# EasyEDA Pro project FOX_HTOL_test_1.0.eprj

# Schematic Schematic1
Create Date: 2023-11-06; Page Name: P1; Project Name: FOX_HTOL; Schematic Name: Schematic1; Update Date: 2023-11-07; Company: 嘉立创EDA; Page Size: A4; Version: V1.0
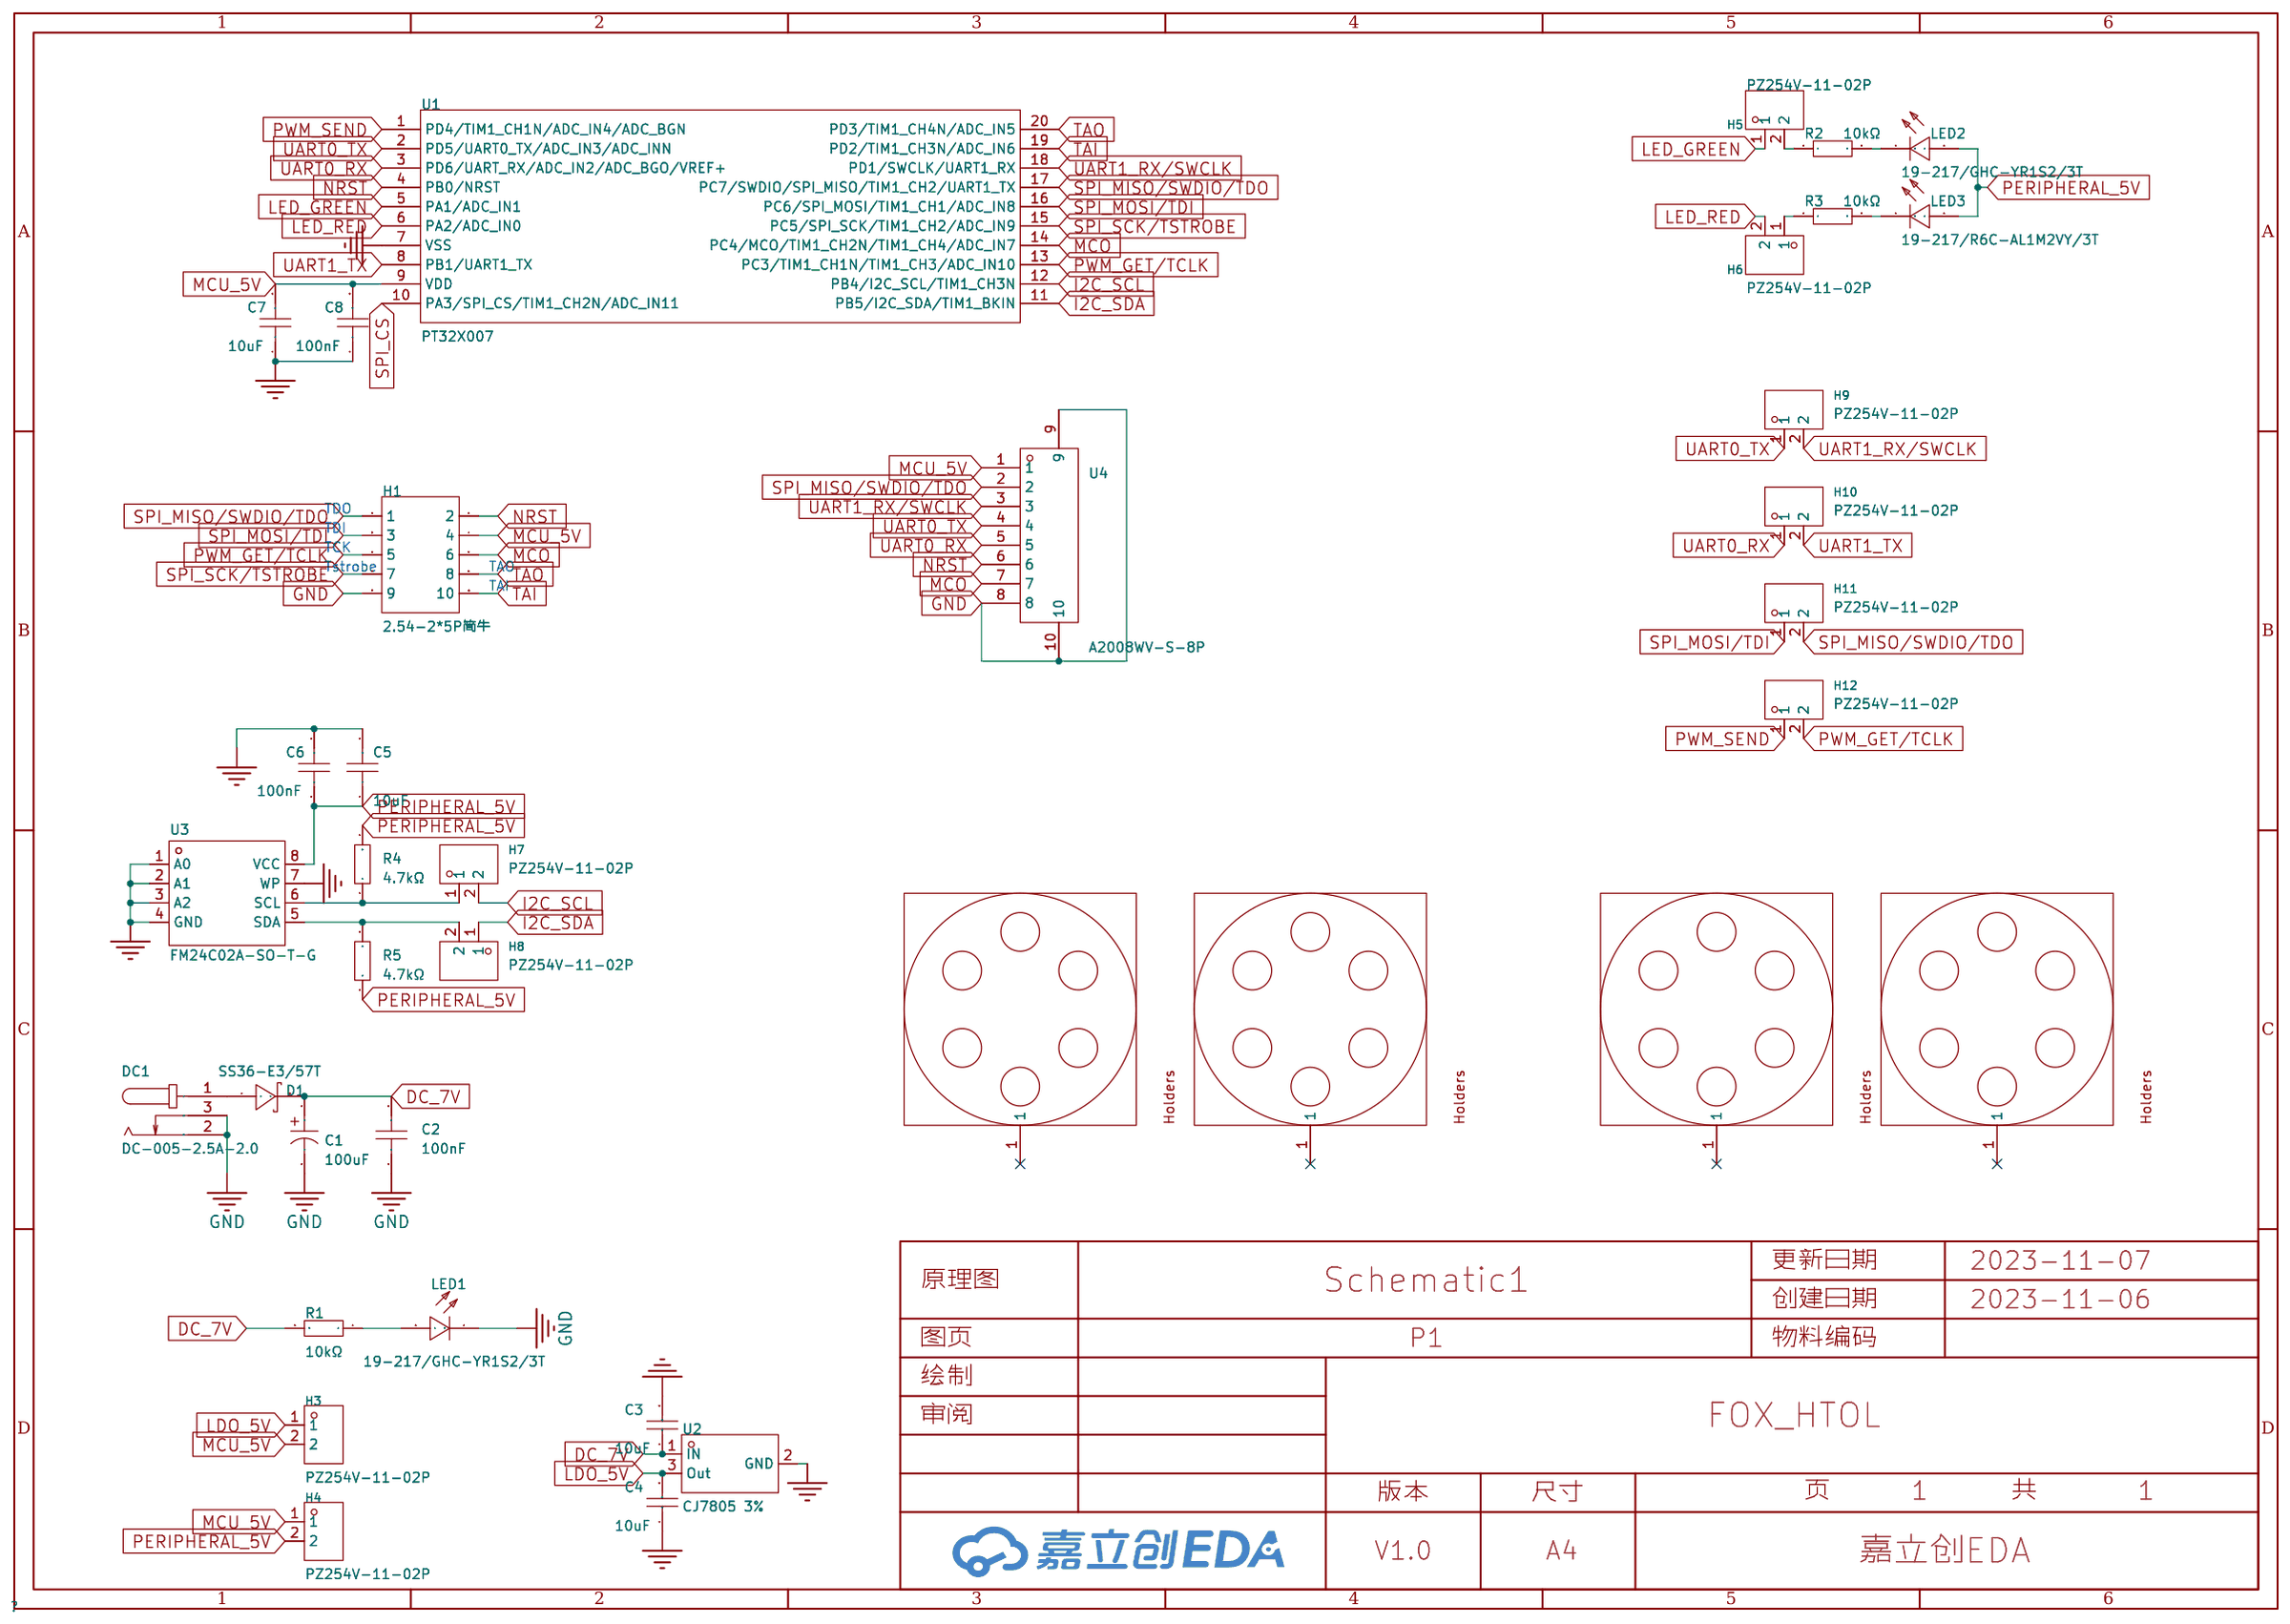
[diagram p0: schematic sheet]

## Parts
C1  100uF  [CAP-SMD_BD6.3-L6.6-W6.6-LS7.6-FD-1]
C2  100nF  [C0603]
C3  10uF  [C1206]
C4  10uF  [C1206]
C5  10uF  [C0603]
C6  100nF  [C0603]
C7  10uF  [C0603]
C8  100nF  [C0603]
D1  SS36-E3/57T  [SMC_L7.1-W6.2-LS8.1-R-RD]
DC1  DC-005-2.5A-2.0  [CONN-TH_DC-005-2.5A-2.0]
H1  2.54-2*5P简牛  [IDC-TH_10P-P2.54_C5665]
H3  PZ254V-11-02P  [HDR-TH_2P-P2.54-V-M]
H4  PZ254V-11-02P  [HDR-TH_2P-P2.54-V-M]
H5  PZ254V-11-02P  [HDR-TH_2P-P2.54-V-M]
H6  PZ254V-11-02P  [HDR-TH_2P-P2.54-V-M]
H7  PZ254V-11-02P  [HDR-TH_2P-P2.54-V-M]
H8  PZ254V-11-02P  [HDR-TH_2P-P2.54-V-M]
H9  PZ254V-11-02P  [HDR-TH_2P-P2.54-V-M]
H10  PZ254V-11-02P  [HDR-TH_2P-P2.54-V-M]
H11  PZ254V-11-02P  [HDR-TH_2P-P2.54-V-M]
H12  PZ254V-11-02P  [HDR-TH_2P-P2.54-V-M]
J2  -  [DEMO板安装孔]
J3  -  [DEMO板安装孔]
J4  -  [DEMO板安装孔]
J5  -  [DEMO板安装孔]
LED1  19-217/GHC-YR1S2/3T  [LED0603-RD]
LED2  19-217/GHC-YR1S2/3T  [LED0603-RD]
LED3  19-217/R6C-AL1M2VY/3T  [LED0603-RD]
R1  10kΩ  [R0603]
R2  10kΩ  [R0603]
R3  10kΩ  [R0603]
R4  4.7kΩ  [R0603]
R5  4.7kΩ  [R0603]
U1  PT32X007  [TSSOP-20_L6.5-W4.4-P0.65-LS6.4-BL]
U2  CJ7805 3%  [TO-252-2_L6.6-W6.1-P4.58-LS10.1-BR-CW]
U3  FM24C02A-SO-T-G  [SOP-8_L5.0-W4.0-P1.27-LS6.2-BL]
U4  A2008WV-S-8P  [CONN-SMD_A2008WV-S-8P]

## Library data of the parts
C1 = RVE100UF35V67RV0072: 容值:100uF;额定电压:35V;电容体直径:-;电容体长度:-;纹波电流:-;等效串联电阻:-;工作寿命:-;; LCSC Part Name: 100uF 35V; Supplier Part: C2836437; Manufacturer: KNSCHA(科尼盛); Supplier Footprint: SMD,6.3x7.7mm; JLCPCB Part Class: Extended Part; Datasheet: https://atta.szlcsc.com/upload/public/pdf/source/20220719/B52EB46F8A1558448ED03D8B4CB3C24F.pdf; Supplier: LCSC; Rated Voltage: 35V
C2 = CL10B104KB8NNNC: 容值:100nF;精度:±10%;额定电压:50V;材质(温度系数):X7R;; LCSC Part Name: 100nF ±10% 50V; Supplier Part: C1591; Manufacturer: SAMSUNG(三星); Supplier Footprint: 0603; JLCPCB Part Class: Extended Part; Datasheet: https://atta.szlcsc.com/upload/public/pdf/source/20160103/1457707680512.pdf; Supplier: LCSC; Tolerance: ±10%; Voltage Rated: 50V; Temperature Coefficient: X7R
C3 C4 = CL31A106KBHNNNE: 容值:10uF;精度:±10%;额定电压:50V;材质(温度系数):X5R;; LCSC Part Name: 10uF ±10% 50V; Supplier Part: C13585; Manufacturer: SAMSUNG(三星); Supplier Footprint: 1206; JLCPCB Part Class: Basic Part; Datasheet: https://atta.szlcsc.com/upload/public/pdf/source/20160103/1457707668742.pdf; Supplier: LCSC; Tolerance: ±10%; Voltage Rated: 50V; Temperature Coefficient: X5R
C5 C7 = CL10A106MA8NRNC: 容值:10uF;精度:±20%;额定电压:25V;材质(温度系数):X5R;; LCSC Part Name: 10uF ±20% 25V; Supplier Part: C96446; Manufacturer: SAMSUNG(三星); Supplier Footprint: 0603; JLCPCB Part Class: Basic Part; Datasheet: https://atta.szlcsc.com/upload/public/pdf/source/20170325/1490427913016.pdf; Supplier: LCSC; Tolerance: ±20%; Voltage Rated: 25V; Temperature Coefficient: X5R
C6 C8 = CC0603KRX7R9BB104: 容值:100nF;精度:±10%;额定电压:50V;材质(温度系数):X7R;; LCSC Part Name: 100nF ±10% 50V; Supplier Part: C14663; Manufacturer: YAGEO(国巨); Supplier Footprint: 0603; JLCPCB Part Class: Basic Part; Datasheet: https://atta.szlcsc.com/upload/public/pdf/source/20180910/C282072_33301C7F631E79921B82A8DAC6BCC5B3.pdf; Supplier: LCSC; Tolerance: ±10%; Voltage Rated: 50V; Temperature Coefficient: X7R
D1 = SS36-E3/57T: 直流反向耐压（Vr）:60V;平均整流电流（Io）:3A;正向压降（Vf）:750mV @ 3A;; Supplier Part: C35722; Manufacturer: VISHAY(威世); Supplier Footprint: SMC(DO-214AB); JLCPCB Part Class: Basic Part; Datasheet: https://atta.szlcsc.com/upload/public/pdf/source/20151007/1457707426323.pdf; Supplier: LCSC
DC1 = DC-005-2.5A-2.0: 连接器类型:DC电源插座;安装方式:面板安装;触点内径:2mm;触点外径:6.2mm;额定电流:2.5A;额定电压:24V;触头材质:黄铜;工作温度范围:-20℃~+70℃;焊接温度(最大值):260℃;; LCSC Part Name: DC电源插座 内径:2mm 外径:6.2mm; Supplier Part: C319099; Manufacturer: XKB Connectivity(中国星坤); Supplier Footprint: 插件; JLCPCB Part Class: Extended Part; Datasheet: https://atta.szlcsc.com/upload/public/pdf/source/20230410/3C172F25A51FCA230ABE6D36425CBB3B.pdf; Supplier: LCSC; Connector Type: DC电源插座; Mounting Style: 面板安装; Inside Contact Diameter: 2mm; Outside Contact Diameter: 6.2mm; Current Rating (Max): 2.5A; Voltage Rating (Max): 24V; Contact Material: 黄铜; Operating Temperature Range: -20℃~+70℃; Welding Temperature (Max): 260℃
H1 = 2.54-2*5P简牛: 连接器类型:简牛座;每排PIN数:5;排数:2;间距:2.54mm;行距:2.54mm;封装形式:直插;触头材质:-;触头镀层:-;; LCSC Part Name: 每排P数:5 排数:2 2.54mm; Supplier Part: C5665; Manufacturer: BOOMELE(博穆精密); Supplier Footprint: 插件,P=2.54mm; JLCPCB Part Class: Extended Part; Datasheet: https://atta.szlcsc.com/upload/public/pdf/source/20140331/1457707037896.pdf; Supplier: LCSC; Connector Type: 简牛座; Pin Number in each Row: 5; Number of Rows: 2; Pitch: 2.54mm; Row Spacing: 2.54mm; Holder Type: 直插
H3-H12 = PZ254V-11-02P: 排数:单排;总PIN位数:2P;间距:2.54mm;插针结构:1x2P;行距:-;安装类型:直插;圆针/方针:方针;额定电流:-;额定电压:-;配合针长度:6mm;塑高:2.5mm;端接针长度:3mm;触头材质:黄铜;触头镀层:-;工作温度范围:-40℃~+105℃;颜色:黑色;; LCSC Part Name: 2.54mm 1x2P 直插 方针; Supplier Part: C492401; Manufacturer: XFCN(兴飞); Supplier Footprint: 插件,P=2.54mm; JLCPCB Part Class: Extended Part; Datasheet: https://atta.szlcsc.com/upload/public/pdf/source/20200309/C492401_A812433581A9B211A7FFA413ADDFF0E5.pdf; Supplier: LCSC; Number of Rows: 单排; Number of Pins: 2P; Pitch: 2.54mm; Pin Structure: 1x2P; Mounting Type: 直插; Circluar Pins/Square Pins: 方针; Length of Mating Pin: 6mm; Insulation Height: 2.5mm; Length of End Connection Pin: 3mm; Contact Material: 黄铜; Operating Temperature Range: -40℃~+105℃; Color: 黑色
J2-J5 = 螺孔_3.1X6MM
LED1 LED2 = 19-217/GHC-YR1S2/3T: 发光颜色:翠绿;二极管配置:-;透镜颜色:无色透明;主波长:520nm~535nm;峰值波长:518nm;色温:-;测试电流:20mA;功率:110mW;发光角度:120°;安装方式:-;工作温度:-40℃~+85℃;; LCSC Part Name: 翠绿 520nm~535nm; Supplier Part: C72043; Manufacturer: EVERLIGHT(亿光); Supplier Footprint: 0603; JLCPCB Part Class: Basic Part; Datasheet: https://atta.szlcsc.com/upload/public/pdf/source/20160507/1462613613780.pdf; Supplier: LCSC; Emitted Color: 翠绿; Lens Color: 无色透明; Dominant Wavelength: 520nm~535nm; Peak Wavelength: 518nm; Forward Current: 20mA; Power Dissipation: 110mW; Viewing Angle: 120°; Operating Temperature: -40℃~+85℃
LED3 = 19-217/R6C-AL1M2VY/3T: 发光颜色:红灯;二极管配置:-;透镜颜色:无色透明;主波长:617.5nm;色温:-;功率:60mW;发光角度:120°;安装方式:-;工作温度:-40℃~+85℃;; LCSC Part Name: 红灯 停产; Supplier Part: C72044; Manufacturer: EVERLIGHT(亿光); Supplier Footprint: 0603; JLCPCB Part Class: Extended Part; Datasheet: https://atta.szlcsc.com/upload/public/pdf/source/20160507/1462613613821.pdf; Supplier: LCSC; Emitted Color: 红灯; Lens Color: 无色透明; Dominant Wavelength: 617.5nm; Peak Wavelength: 632nm; Forward Current: 5mA; Forward Voltage (VF): 1.95V; Power Dissipation: 60mW; Viewing Angle: 120°; Operating Temperature: -40℃~+85℃
R1 = 0603WAF1002T5E: 电阻类型:厚膜电阻;阻值:10kΩ;精度:±1%;功率:100mW;温度系数:±100ppm/℃;最大工作电压:75V;工作温度范围:-55℃~+155℃;; LCSC Part Name: 10kΩ ±1% 100mW; Supplier Part: C25804; Manufacturer: UNI-ROYAL(厚声); Supplier Footprint: 0603; JLCPCB Part Class: Basic Part; Datasheet: https://atta.szlcsc.com/upload/public/pdf/source/20200306/C422600_1E6D84923E4A46A82E41ADD87F860B5C.pdf; Supplier: LCSC; Type: 厚膜电阻; Tolerance: ±1%; Power(Watts): 100mW; Temperature Coefficient: ±100ppm/℃; Overload Voltage (Max): 75V; Operating Temperature Range: -55℃~+155℃
R2 R3 = 0603WAF1002T5E: 电阻类型:厚膜电阻;阻值:10kΩ;精度:±1%;功率:100mW;; LCSC Part Name: 10kΩ ±1% 100mW; Supplier Part: C25804; Manufacturer: UNI-ROYAL(厚声); Supplier Footprint: 0603; JLCPCB Part Class: Basic Part; Datasheet: https://atta.szlcsc.com/upload/public/pdf/source/20200306/C422600_1E6D84923E4A46A82E41ADD87F860B5C.pdf; Supplier: LCSC; Type: 厚膜电阻; Tolerance: ±1%; Power(Watts): 100mW; Temperature Coefficient: ±100ppm/℃; Overload Voltage (Max): 75V; Operating Temperature Range: -55℃~+155℃
R4 R5 = 0603WAF4701T5E: 电阻类型:厚膜电阻;阻值:4.7kΩ;精度:±1%;功率:100mW;温度系数:±100ppm/℃;; LCSC Part Name: 厚膜电阻 4.7kΩ ±1% 100mW; Supplier Part: C23162; Manufacturer: UNI-ROYAL(厚声); Supplier Footprint: 0603; JLCPCB Part Class: Basic Part; Datasheet: https://atta.szlcsc.com/upload/public/pdf/source/20200306/C422600_1E6D84923E4A46A82E41ADD87F860B5C.pdf; Supplier: LCSC; Type: 厚膜电阻; Tolerance: ±1%; Power(Watts): 100mW; Temperature Coefficient: ±100ppm/℃; Overload Voltage (Max): 75V; Operating Temperature Range: -55℃~+155℃
U1 = PT32X007
U2 = CJ7805 3%: 输出类型:固定;输出极性:正;最大输入电压:35V;输出电压:5V;输出电流:1.5A;; LCSC Part Name: 3%; Supplier Part: C21706; Manufacturer: CJ(江苏长电/长晶); Supplier Footprint: TO-252-2(DPAK); JLCPCB Part Class: Extended Part; Datasheet: https://atta.szlcsc.com/upload/public/pdf/source/20171106/C21706_15099535628491092916.pdf; Supplier: LCSC; Output Type: 固定; Output Polarity: 正; Number of Outputs: 1; Maximum Input Voltage: 35V; Output Voltage: 5V; Dropout Voltage: 2V@(1A); Output Current: 1.5A
U3 = FM24C02A-SO-T-G: 2-Kbit(256 x 8bit)，I2C接口，工作电压：1.7V to 5.5V; Supplier Part: C9997; Manufacturer: FM(复旦微); Supplier Footprint: SOP-8; JLCPCB Part Class: Extended Part; Datasheet: https://atta.szlcsc.com/upload/public/pdf/source/20140226/1457706994856.pdf; Supplier: LCSC
U4 = A2008WV-S-8P: 参考系列:PH;间距:2mm;插针结构:1x8P;排数:1;每排PIN数:8;行距:-;安装方式:-;触头材质:黄铜;; LCSC Part Name: PH 2mm 1x8P 镀锡; Supplier Part: C273128; Manufacturer: CJT(长江连接器); Supplier Footprint: SMD,P=2mm; JLCPCB Part Class: Extended Part; Datasheet: https://atta.szlcsc.com/upload/public/pdf/source/20180913/C273128_BB1852F7672CD820F7AD4E26555E7BEC.pdf; Supplier: LCSC; Reference Series: PH; Pitch: 2mm; Pins Structure: 1x8P; Number of Rows: 1; Number of PINs Per Row: 8; Contact Material: 黄铜

## Nets
GND: C1.2 C2.1 C3.2 C4.1 C5.2 C6.2 C7.1 C8.1 DC1.2 DC1.3 H1.9 LED1.1(C) U1.7(VSS) U2.2(GND) U3.1(A0) U3.2(A1) U3.3(A2) U3.4(GND) U3.7(WP) U4.8 U4.9 U4.10
DC_7V: C1.1 C2.2 C3.1 D1.2(K) R1.2 U2.1(IN)
I2C_SCL: H7.2 U1.12(PB4/I2C_SCL/TIM1_CH3N)
I2C_SDA: H8.1 U1.11(PB5/I2C_SDA/TIM1_BKIN)
LDO_5V: C4.2 H3.1 U2.3(Out)
LED_GREEN: H5.1 U1.5(PA1/ADC_IN1)
LED_RED: H6.2 U1.6(PA2/ADC_IN0)
MCO: H1.6 U1.14(PC4/MCO/TIM1_CH2N/TIM1_CH4/ADC_IN7) U4.7
MCU_5V: C7.2 C8.2 H1.4 H3.2 H4.1 U1.9(VDD) U4.1
NRST: H1.2 U1.4(PB0/NRST) U4.6
PERIPHERAL_5V: C5.1 C6.1 H4.2 LED2.2(A) LED3.2(A) R4.2 R5.1 U3.8(VCC)
PWM_GET/TCLK: H1.5 H12.2 U1.13(PC3/TIM1_CH1N/TIM1_CH3/ADC_IN10)
PWM_SEND: H12.1 U1.1(PD4/TIM1_CH1N/ADC_IN4/ADC_BGN)
SPI_CS: U1.10(PA3/SPI_CS/TIM1_CH2N/ADC_IN11)
SPI_MISO/SWDIO/TDO: H1.1 H11.2 U1.17(PC7/SWDIO/SPI_MISO/TIM1_CH2/UART1_TX) U4.2
SPI_MOSI/TDI: H1.3 H11.1 U1.16(PC6/SPI_MOSI/TIM1_CH1/ADC_IN8)
SPI_SCK/TSTROBE: H1.7 U1.15(PC5/SPI_SCK/TIM1_CH2/ADC_IN9)
TAI: H1.10 U1.19(PD2/TIM1_CH3N/ADC_IN6)
TAO: H1.8 U1.20(PD3/TIM1_CH4N/ADC_IN5)
UART0_RX: H10.1 U1.3(PD6/UART_RX/ADC_IN2/ADC_BGO/VREF+) U4.5
UART0_TX: H9.1 U1.2(PD5/UART0_TX/ADC_IN3/ADC_INN) U4.4
UART1_RX/SWCLK: H9.2 U1.18(PD1/SWCLK/UART1_RX) U4.3
UART1_TX: H10.2 U1.8(PB1/UART1_TX)
$1N831: D1.1(A) DC1.1
$1N1246: LED1.2(A) R1.1
$1N1959: H5.2 R2.1
$1N1962: H6.1 R3.1
$1N1965: LED2.1(C) R2.2
$1N1968: LED3.1(C) R3.2
$1N2989: H7.1 R4.1 U3.6(SCL)
$1N3006: H8.2 R5.2 U3.5(SDA)

Not connected (* = marked no-connect by the designer): J2 1*; J3 1*; J4 1*; J5 1*

## Notes on the sheet
- TDO
- TDI
- TCK
- Tstrobe
- TAI
- TAO

# Board PCB1
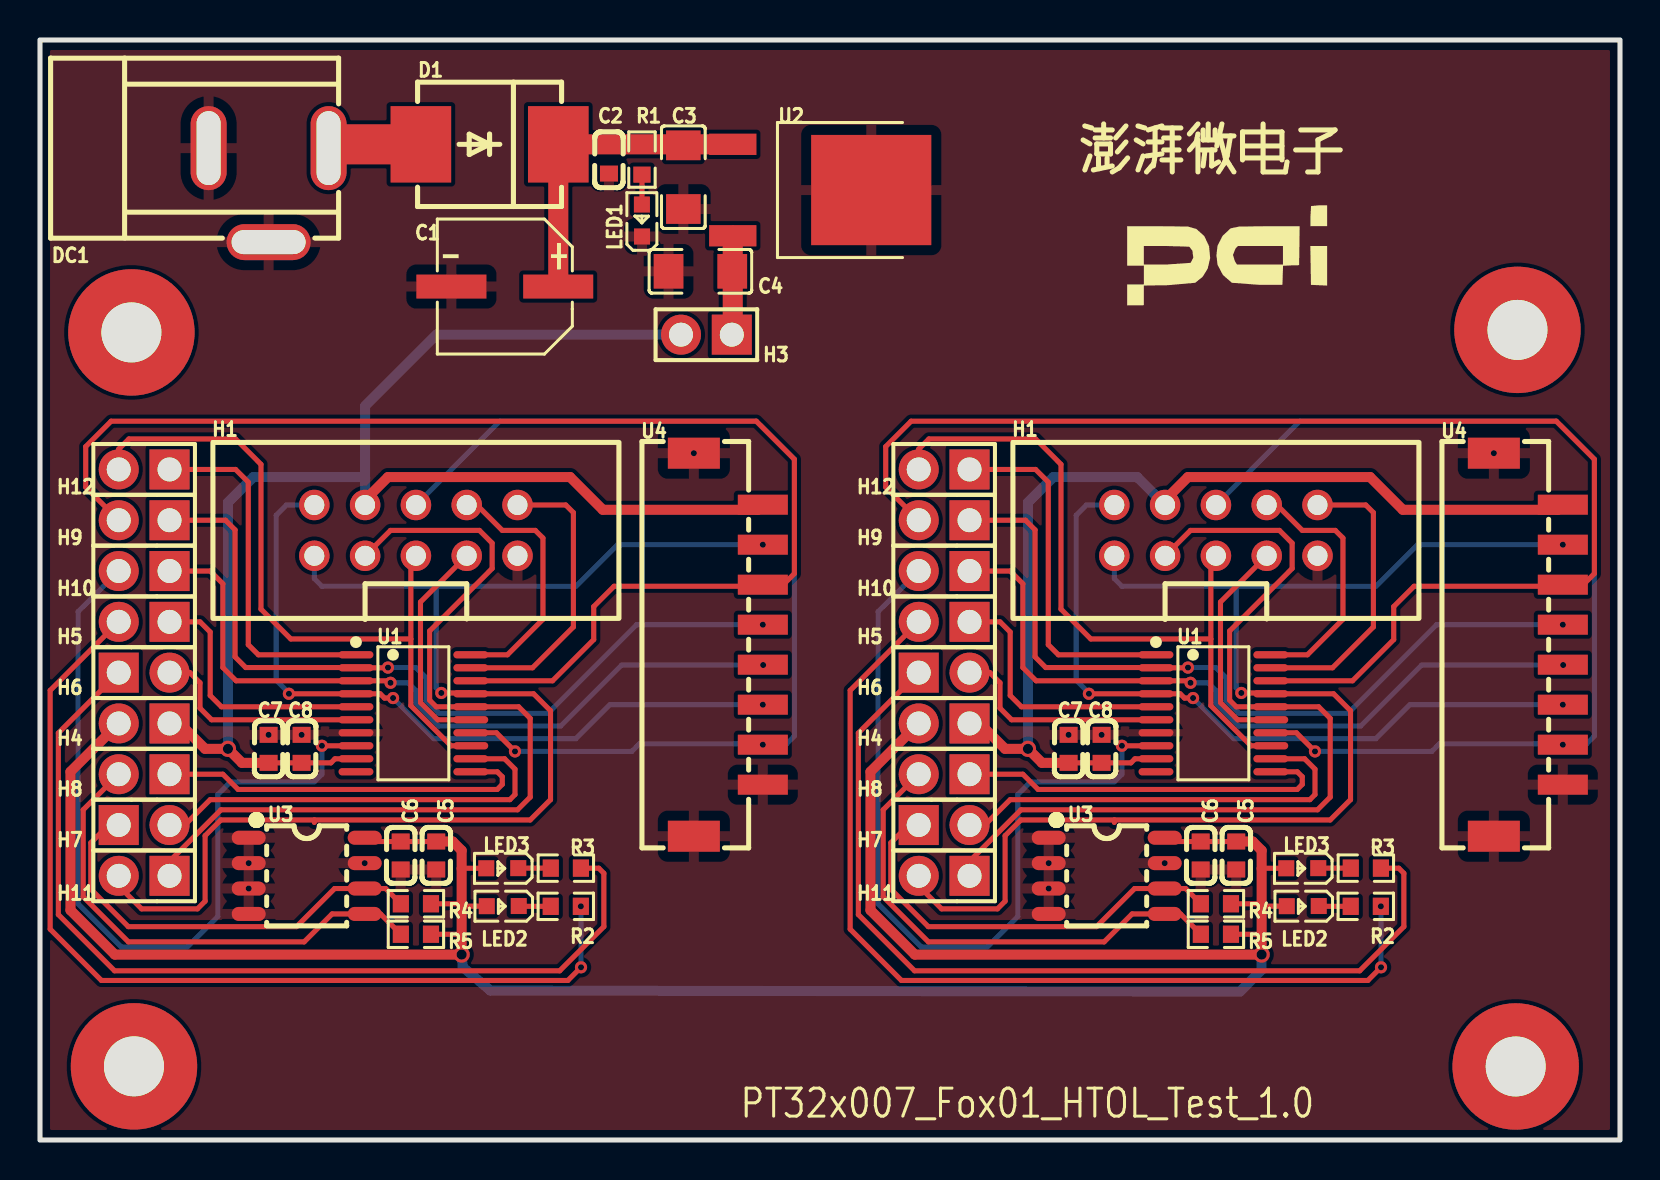
[diagram p1: board, top side]
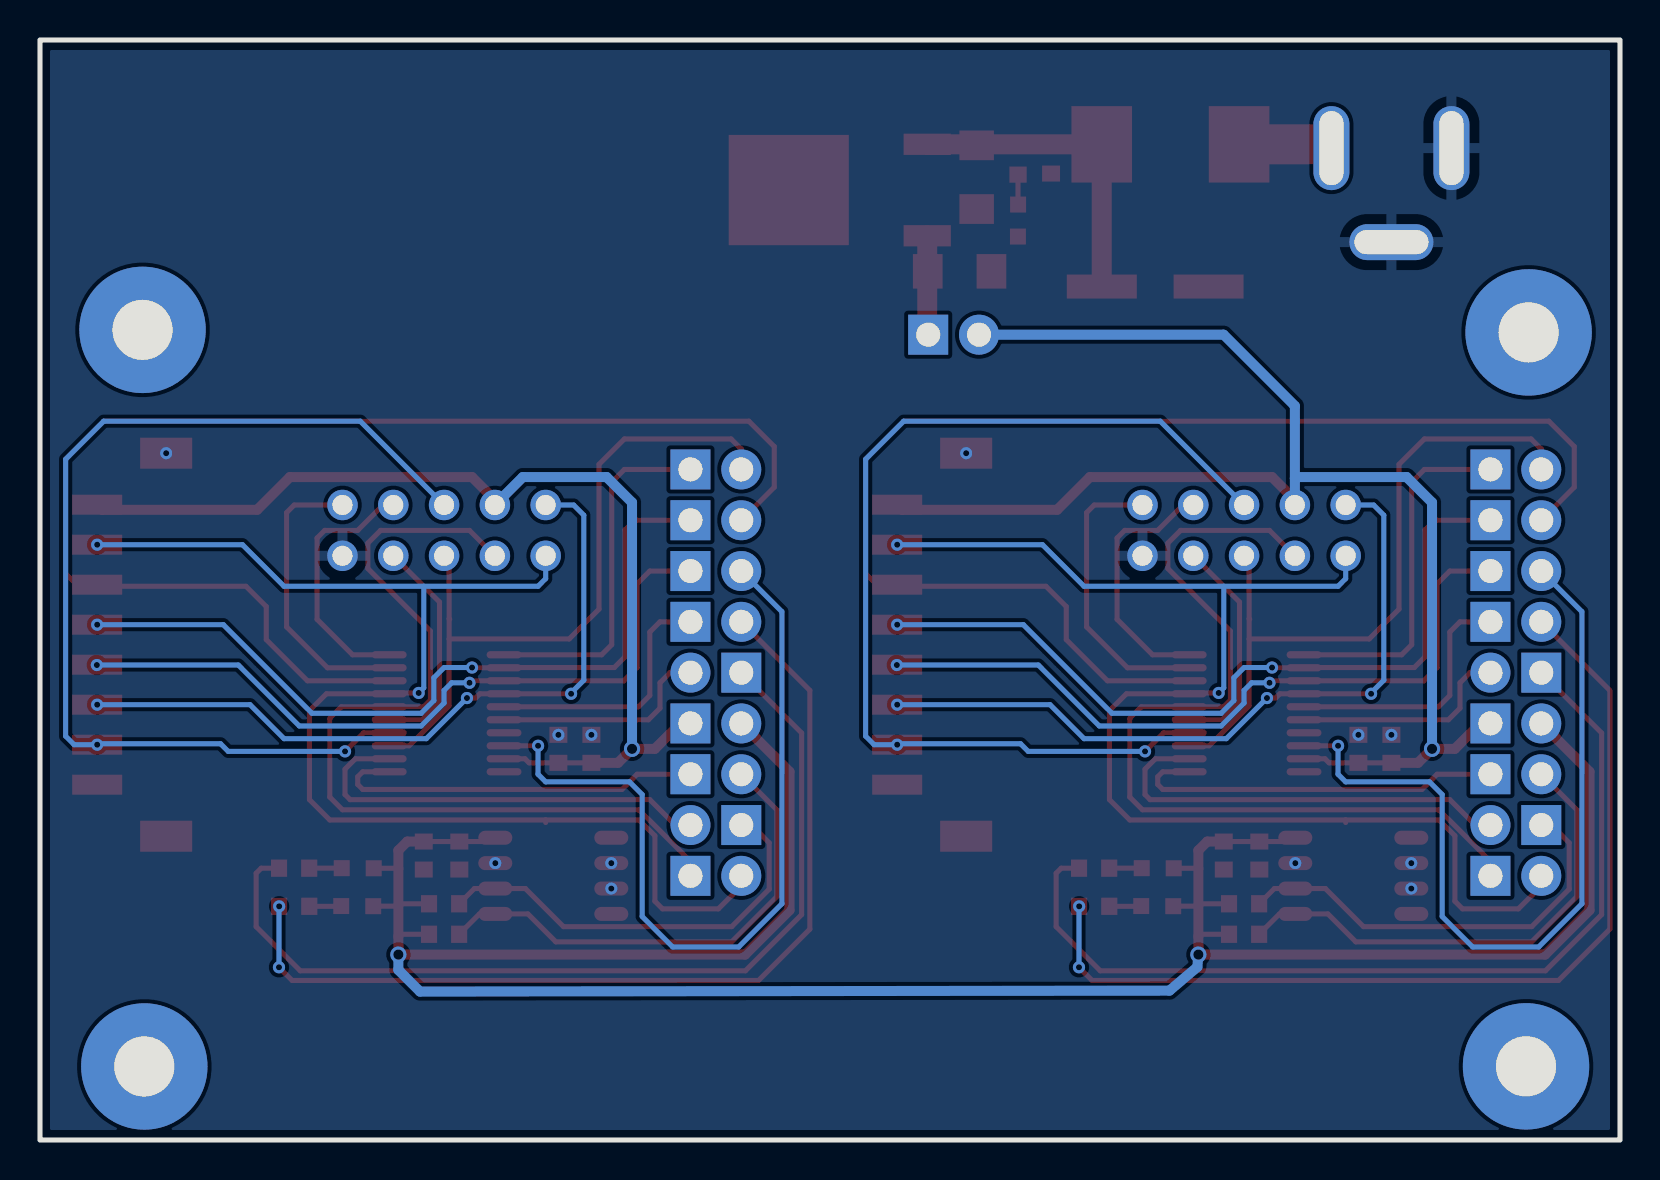
[diagram p2: board, bottom side, seen from below]

Outline 79 x 55 mm; copper layers: Top Layer, Bottom Layer. Coordinates in mm from the lower left corner of the outline.
Outline path: rectangle 0,55 79,0
Stack: Top Layer 0.035mm / Dielectric1 1.51mm FR4 er 4.5 / Bottom Layer 0.035mm

## Design rules (mm)
template: 自定义配置
spacing copperThickness1oz (default): track to track 0.102, other pairs 0.152 to 0.3
spacing copperThickness2oz: track to track 0.203, other pairs 0.152 to 0.3
track width copperThickness1oz (default): min 0.127, default 0.254, max 2.54
track width copperThickness2oz: min 0.203, default 0.254, max 2.54
differential pair differentialPair (default): width min 0.127, default 0.254, max 2.54; gap min 0.152, default 0.152
via viaSize (default): diameter min 0.5, default 0.61, max 10; hole min 0.3, default 0.305, max 6.3

## Placement (name value [footprint] x y rotation side)
C1  100uF  [CAP-SMD_BD6.3-L6.6-W6.6-LS7.6-FD-1]  23.24 42.67 180 top
C2  100nF  [C0603]  28.45 49.02 90 top
C3  10uF  [C1206]  32.17 48.14 270 top
C4  10uF  [C1206]  33.02 43.43 0 top
C5  10uF  [C0603]  19.81 14.22 270 top
C5#2  -  [C0603]  59.81 14.22 270 top
C6  100nF  [C0603]  18.03 14.22 270 top
C6#2  -  [C0603]  58.03 14.22 270 top
C7  10uF  [C0603]  11.43 19.56 270 top
C7#2  -  [C0603]  51.43 19.56 270 top
C8  100nF  [C0603]  53.08 19.56 270 top
C8#2  -  [C0603]  13.08 19.56 270 top
D1  SS36-E3/57T  [SMC_L7.1-W6.2-LS8.1-R-RD]  22.48 49.78 180 top
DC1  DC-005-2.5A-2.0  [CONN-TH_DC-005-2.5A-2.0]  11.43 47.24 0 top
H1  2.54-2*5P简牛  [IDC-TH_10P-P2.54_C5665]  58.8 30.48 0 top
H1#2  -  [IDC-TH_10P-P2.54_C5665]  18.8 30.48 0 top
H3  PZ254V-11-02P  [HDR-TH_2P-P2.54-V-M]  33.32 40.27 180 top
H4  PZ254V-11-02P  [HDR-TH_2P-P2.54-V-M]  45.21 20.83 180 top
H4#2  -  [HDR-TH_2P-P2.54-V-M]  5.21 20.83 180 top
H5  PZ254V-11-02P  [HDR-TH_2P-P2.54-V-M]  45.21 25.91 180 top
H5#2  -  [HDR-TH_2P-P2.54-V-M]  5.21 25.91 180 top
H6  PZ254V-11-02P  [HDR-TH_2P-P2.54-V-M]  45.21 23.37 0 top
H6#2  -  [HDR-TH_2P-P2.54-V-M]  5.21 23.37 0 top
H7  PZ254V-11-02P  [HDR-TH_2P-P2.54-V-M]  5.21 15.75 0 top
H7#2  -  [HDR-TH_2P-P2.54-V-M]  45.21 15.75 0 top
H8  PZ254V-11-02P  [HDR-TH_2P-P2.54-V-M]  5.21 18.29 180 top
H8#2  -  [HDR-TH_2P-P2.54-V-M]  45.21 18.29 180 top
H9  PZ254V-11-02P  [HDR-TH_2P-P2.54-V-M]  5.21 30.99 180 top
H9#2  -  [HDR-TH_2P-P2.54-V-M]  45.21 30.99 180 top
H10  PZ254V-11-02P  [HDR-TH_2P-P2.54-V-M]  5.21 28.45 180 top
H10#2  -  [HDR-TH_2P-P2.54-V-M]  45.21 28.45 180 top
H11  PZ254V-11-02P  [HDR-TH_2P-P2.54-V-M]  5.21 13.21 180 top
H11#2  -  [HDR-TH_2P-P2.54-V-M]  45.21 13.21 180 top
H12  PZ254V-11-02P  [HDR-TH_2P-P2.54-V-M]  5.21 33.53 180 top
H12#2  -  [HDR-TH_2P-P2.54-V-M]  45.21 33.53 180 top
J2  -  [DEMO板安装孔]  73.87 40.51 0 top
J3  -  [DEMO板安装孔]  4.57 40.38 0 top
J4  -  [DEMO板安装孔]  73.79 3.68 0 top
J5  -  [DEMO板安装孔]  4.7 3.68 0 top
LED1  19-217/GHC-YR1S2/3T  [LED0603-RD]  30.1 45.97 90 top
LED2  19-217/GHC-YR1S2/3T  [LED0603-RD]  23.14 11.69 180 top
LED2#2  -  [LED0603-RD]  63.14 11.69 180 top
LED3  19-217/R6C-AL1M2VY/3T  [LED0603-RD]  23.11 13.59 180 top
LED3#2  -  [LED0603-RD]  63.11 13.59 180 top
R1  10kΩ  [R0603]  30.1 49.02 90 top
R2  10kΩ  [R0603]  26.29 11.68 180 top
R2#2  -  [R0603]  66.29 11.68 180 top
R3  10kΩ  [R0603]  26.29 13.59 180 top
R3#2  -  [R0603]  66.29 13.59 180 top
R4  4.7kΩ  [R0603]  18.8 11.81 0 top
R4#2  -  [R0603]  58.8 11.81 0 top
R5  4.7kΩ  [R0603]  18.8 10.29 180 top
R5#2  -  [R0603]  58.8 10.29 180 top
U1  PT32X007  [TSSOP-20_L6.5-W4.4-P0.65-LS6.4-BL]  18.67 21.34 270 top
U1#2  -  [TSSOP-20_L6.5-W4.4-P0.65-LS6.4-BL]  58.67 21.34 270 top
U2  CJ7805 3%  [TO-252-2_L6.6-W6.1-P4.58-LS10.1-BR-CW]  38.1 47.5 180 top
U3  FM24C02A-SO-T-G  [SOP-8_L5.0-W4.0-P1.27-LS6.2-BL]  13.34 13.21 270 top
U3#2  -  [SOP-8_L5.0-W4.0-P1.27-LS6.2-BL]  53.33 13.21 270 top
U4  A2008WV-S-8P  [CONN-SMD_A2008WV-S-8P]  34.42 24.77 270 top
U4#2  -  [CONN-SMD_A2008WV-S-8P]  74.42 24.77 270 top

## Footprints (pads in the part's own frame, mm; a bottom-side part is the same pattern mirrored in y, then rotated)
C0603
  rect 0.8x0.9 smd: 1(-0.7,0) 2(0.7,0)
C1206
  rect 1.485x1.728 smd: 1(-1.593,0) 2(1.593,0)
CAP-SMD_BD6.3-L6.6-W6.6-LS7.6-FD-1
  rect 3.5x1.2 smd: 1(-2.67,0) 2(2.67,0)
CONN-SMD_A2008WV-S-8P
  rect 1x2.5 smd: 1(-7,1.724) 2(-5,1.724) 3(-3,1.724) 4(-1,1.724) 5(1,1.724) 6(2.999,1.724) 7(5,1.724) 8(7,1.724)
  rect 1.55x2.6 smd: 9(-9.575,-1.724) 10(9.575,-1.724)
CONN-TH_DC-005-2.5A-2.0
  oval 1.8x4.2 hole 1.2x3.7: 1(2.999,2.35) 2(-2.999,2.35)
  oval 4.2x1.8 hole 3.7x1.2: 3(0,-2.35)
DEMO板安装孔
  round 6.32 hole 3: 1(0,0)
HDR-TH_2P-P2.54-V-M
  rect 2x2 hole 1.2: 1(-1.27,0)
  round 2 hole 1.2: 2(1.27,0)
IDC-TH_10P-P2.54_C5665
  round 1.524 hole 1: 1(-5.08,-1.27) 2(-5.08,1.27) 3(-2.54,-1.27) 4(-2.54,1.27) 5(0,-1.27) 6(0,1.27) 7(2.54,-1.27) 8(2.54,1.27) 9(5.08,-1.27) 10(5.08,1.27)
LED0603-RD
  rect 0.8x0.8 smd: 1(-0.799,-0.004) 2(0.799,0.004)
R0603
  rect 0.806x0.864 smd: 1(-0.753,0) 2(0.753,0)
SMC_L7.1-W6.2-LS8.1-R-RD
  rect 3.03x3.82 smd: 1(3.435,0) 2(-3.435,0)
SOP-8_L5.0-W4.0-P1.27-LS6.2-BL
  oval 0.7x1.7 smd: 1(-1.905,-2.9) 2(-0.635,-2.9) 3(0.635,-2.9) 4(1.905,-2.9) 5(1.905,2.9) 6(0.635,2.9) 7(-0.635,2.9) 8(-1.905,2.9)
TO-252-2_L6.6-W6.1-P4.58-LS10.1-BR-CW
  rect 2.364x1.064 smd: 1(3.462,-2.286) 3(3.462,2.286)
  rect 6.004x5.512 smd: 2(-3.462,0)
TSSOP-20_L6.5-W4.4-P0.65-LS6.4-BL
  oval 0.364x1.742 smd: 1(-2.925,-2.871) 2(-2.275,-2.871) 3(-1.625,-2.871) 4(-0.975,-2.871) 5(-0.325,-2.871) 6(0.325,-2.871) 7(0.975,-2.871) 8(1.625,-2.871) 9(2.275,-2.871) 10(2.925,-2.871) 11(2.925,2.871) 12(2.275,2.871) 13(1.625,2.871) 14(0.975,2.871) 15(0.325,2.871) 16(-0.325,2.871) 17(-0.975,2.871) 18(-1.625,2.871) 19(-2.275,2.871) 20(-2.925,2.871)

## Nets
GND: C1.2 C2.1 C3.2 C4.1 C5.2 C5#2.2 C6.2 C6#2.2 C7.1 C7#2.1 C8.1 C8#2.1 DC1.2 DC1.3 H1.9 H1#2.9 LED1.1 U1.7 U1#2.7 U2.2 U3.1 U3.2 U3.3 U3.4 U3.7 U3#2.1 U3#2.2 U3#2.3 U3#2.4 U3#2.7 U4.8 U4.9 U4.10 U4#2.8 U4#2.9 U4#2.10
DC_7V: C1.1 C2.2 C3.1 D1.2 R1.2 U2.1
I2C_SCL: H7.2 H7#2.2 U1.12 U1#2.12
I2C_SDA: H8.1 H8#2.1 U1.11 U1#2.11
LDO_5V: C4.2 H3.1 U2.3
LED_GREEN: H5.1 H5#2.1 U1.5 U1#2.5
LED_RED: H6.2 H6#2.2 U1.6 U1#2.6
MCO: H1.6 H1#2.6 U1.14 U1#2.14 U4.7 U4#2.7
MCU_5V: C7.2 C7#2.2 C8.2 C8#2.2 H1.4 H1#2.4 H3.2 H4.1 H4#2.1 U1.9 U1#2.9 U4.1 U4#2.1
NRST: H1.2 H1#2.2 U1.4 U1#2.4 U4.6 U4#2.6
PERIPHERAL_5V: C5.1 C5#2.1 C6.1 C6#2.1 H4.2 H4#2.2 LED2.2 LED2#2.2 LED3.2 LED3#2.2 R4.2 R4#2.2 R5.1 R5#2.1 U3.8 U3#2.8
PWM_GET/TCLK: H1.5 H1#2.5 H12.2 H12#2.2 U1.13 U1#2.13
PWM_SEND: H12.1 H12#2.1 U1.1 U1#2.1
SPI_CS: U1.10 U1#2.10
SPI_MISO/SWDIO/TDO: H1.1 H1#2.1 H11.2 H11#2.2 U1.17 U1#2.17 U4.2 U4#2.2
SPI_MOSI/TDI: H1.3 H1#2.3 H11.1 H11#2.1 U1.16 U1#2.16
SPI_SCK/TSTROBE: H1.7 H1#2.7 U1.15 U1#2.15
TAI: H1.10 H1#2.10 U1.19 U1#2.19
TAO: H1.8 H1#2.8 U1.20 U1#2.20
UART0_RX: H10.1 H10#2.1 U1.3 U1#2.3 U4.5 U4#2.5
UART0_TX: H9.1 H9#2.1 U1.2 U1#2.2 U4.4 U4#2.4
UART1_RX/SWCLK: H9.2 H9#2.2 U1.18 U1#2.18 U4.3 U4#2.3
UART1_TX: H10.2 H10#2.2 U1.8 U1#2.8
$1N831: D1.1 DC1.1
$1N1246: LED1.2 R1.1
$1N1959: H5.2 H5#2.2 R2.1 R2#2.1
$1N1962: H6.1 H6#2.1 R3.1 R3#2.1
$1N1965: LED2.1 LED2#2.1 R2.2 R2#2.2
$1N1968: LED3.1 LED3#2.1 R3.2 R3#2.2
$1N2989: H7.1 H7#2.1 R4.1 R4#2.1 U3.6 U3#2.6
$1N3006: H8.2 H8#2.2 R5.2 R5#2.2 U3.5 U3#2.5

Pads without a net: J2 1; J3 1; J4 1; J5 1

## Via types
v1: diameter 0.61, hole 0.305, Top Layer to Bottom Layer, 40 vias
v2: diameter 0.81, hole 0.51, Top Layer to Bottom Layer, 4 vias

## Routing (per net, layer and track width the routed paths; a pad name or vN(x,y) marks a point on that pad's centre or on a via; arc(x,y) is an arc through that point)
GND:
  vias: v1(10.44,13.84) v1(10.44,12.57) v1(11.43,20.26) v1(13.08,20.26) v1(16.23,13.84) v1(32.69,34.34) v1(50.44,13.84) v1(50.44,12.57) v1(51.43,20.26) v1(53.08,20.26) v1(56.23,13.84) v1(72.69,34.34)
DC_7V: length 15.8
  Top Layer w1: U2.1 D1.2 25.91,42.68 25.91,42.67
I2C_SCL: length 43.4
  Top Layer w0.254: H7#2.2 46.6,15.62 47.11,15.62 48.51,17.02 63.5,17.02 63.75,17.27 63.75,18.54 63.23,19.06 U1#2.12 ; U1.12 23.23,19.06 23.75,18.54 23.75,17.27 23.5,17.02 8.51,17.02 7.11,15.62 6.6,15.62 H7.2
I2C_SDA: length 38.2
  Top Layer w0.254: U1#2.11 62.86,18.41 63.11,18.16 63.11,17.78 62.86,17.53 49.91,17.53 49.14,18.29 H8#2.1 ; U1.11 22.86,18.41 23.11,18.16 23.11,17.78 22.86,17.53 9.91,17.53 9.14,18.29 H8.1
LDO_5V: length 5
  Top Layer w1: H3.1 34.64,40.31 U2.3
LED_GREEN: length 25.9
  Top Layer w0.254: U1.5 9.07,21.66 8.51,22.23 8.51,25.4 8,25.91 H5#2.1 ; U1#2.5 49.07,21.66 48.51,22.23 48.51,25.4 48,25.91 H5.1
LED_RED: length 22.1
  Top Layer w0.254: H6.2 47.49,23.37 48,22.86 48,21.59 48.58,21.01 U1#2.6 ; H6#2.2 7.49,23.37 8,22.86 8,21.59 8.58,21.01 U1.6
MCO: length 104.6
  Top Layer w0.254: v1(63.75,19.43) 62.82,20.36 U1#2.14 ; v1(76.14,19.77) 76.1,19.81 76.07,19.81 ; v1(23.75,19.43) 22.82,20.36 U1.14 ; v1(36.14,19.77) 36.1,19.81 36.07,19.81
  Bottom Layer w0.254: v1(63.75,19.43) 69.59,19.43 69.97,19.81 76.1,19.81 v1(76.14,19.77) 77.29,19.77 77.72,20.19 77.72,34.04 75.81,35.94 62.99,35.94 H1.6 ; H1#2.6 22.99,35.94 35.81,35.94 37.72,34.04 37.72,20.19 37.29,19.77 v1(36.14,19.77) 36.1,19.81 29.97,19.81 29.59,19.43 v1(23.75,19.43)
MCU_5V: length 125.5
  Top Layer w0.254: C7#2.2 C8.2 54.55,18.86 54.75,19.06 U1#2.9 ; C7.2 C8#2.2 14.55,18.86 14.75,19.06 U1.9
  Top Layer w0.5: C7#2.2 50.1,18.86 v2(49.4,19.56) 48.26,19.56 46.98,20.83 H4.1 ; U4#2.1 75.89,31.51 68.14,31.51 66.5,33.15 57.4,33.15 56.26,32 H1.4 ; U4.1 35.89,31.51 28.14,31.51 26.5,33.15 17.4,33.15 16.26,32 H1#2.4 ; H4#2.1 6.98,20.83 8.26,19.56 v2(9.4,19.56) 10.1,18.86 C7.2
  Bottom Layer w0.5: v2(9.4,19.56) 9.4,31.88 10.67,33.15 16.19,33.15 16.26,33.09 ; H1.4 54.86,33.15 50.67,33.15 49.4,31.88 v2(49.4,19.56) ; H3.2 19.82,40.27 16.26,36.7 16.26,33.09 ; 16.26,33.09 H1#2.4
NRST: length 73.4
  Top Layer w0.254: v1(57.65,22.1) 57.22,22.1 57.01,22.31 U1#2.4 v1(52.45,22.31) ; v1(17.65,22.1) 17.22,22.1 17.01,22.31 U1.4 v1(12.45,22.31) ; v1(76.14,21.77) 76.19,21.72 76.2,21.72 ; v1(36.14,21.77) 36.19,21.72 36.2,21.72
  Bottom Layer w0.254: v1(12.45,22.31) 12.45,22.35 11.81,22.99 11.81,31.24 12.32,31.75 H1#2.2 ; H1.2 52.32,31.75 51.81,31.24 51.81,22.99 52.45,22.35 v1(52.45,22.31) ; v1(57.65,22.1) 59.69,20.07 66.8,20.07 68.5,21.77 v1(76.14,21.77) ; v1(36.14,21.77) 28.5,21.77 26.8,20.07 19.69,20.07 v1(17.65,22.1)
PERIPHERAL_5V: length 135.8
  Top Layer w0.254: U3.8 16.42,14.92 C6.1 C5.1 ; LED3#2.2 61.1,13.59 61.08,13.57 ; R5.1 20.97,10.29 21.08,10.18 ; LED2#2.2 61.12,11.69 61.08,11.73 61,11.81 R4#2.2 ; R5#2.1 60.97,10.29 61.08,10.18 ; LED2.2 21.12,11.69 21.08,11.73 21,11.81 R4.2 ; 21.08,13.57 21.1,13.59 LED3.2 ; U3#2.8 56.42,14.92 C6#2.1 C5#2.1
  Top Layer w0.5: C5.1 20.64,14.92 21.08,14.48 v2(21.08,9.27) 3.74,9.27 1.52,11.49 1.52,18.42 H4#2.2 ; C5#2.1 60.64,14.92 61.08,14.48 v2(61.08,9.27) 43.74,9.27 41.52,11.49 41.52,18.42 H4.2
  Bottom Layer w0.5: v2(61.08,9.27) 61.08,8.5 60,7.42 22.52,7.47 21.13,8.65 v2(21.08,9.27)
PWM_GET/TCLK: length 71.6
  Top Layer w0.254: H1.5 58.54,28.96 58.54,26.06 ; 18.52,26.04 18.54,26.06 ; 18.54,26.06 18.54,25.05 ; 18.54,26.06 18.54,28.96 H1#2.5 ; 58.54,25.05 58.54,21.72 60.55,19.71 61.67,19.71 ; 58.54,25.05 58.54,26.06 ; 58.54,25.05 52.54,25.05 51.05,26.54 51.05,33.78 49.78,35.05 44.45,35.05 43.94,34.54 H12#2.2 ; 18.54,25.05 18.54,21.72 20.55,19.71 21.67,19.71 ; 18.54,25.05 12.54,25.05 11.05,26.54 11.05,33.78 9.78,35.05 4.45,35.05 3.94,34.54 H12.2 ; 58.52,26.04 58.54,26.06
PWM_SEND: length 35.8
  Top Layer w0.254: U1#2.1 50.92,24.26 50.41,24.77 50.41,32.89 49.78,33.53 H12#2.1 ; U1.1 10.92,24.26 10.41,24.77 10.41,32.89 9.78,33.53 H12.1
SPI_MISO/SWDIO/TDO: length 134.4
  Top Layer w0.254: v1(20.07,22.35) 21.5,22.35 U1.17 24.68,22.31 25.53,21.46 25.53,17.02 24.51,16 13.72,16 ; v1(60.07,22.35) 61.5,22.35 U1#2.17 64.68,22.31 65.53,21.46 65.53,17.02 64.51,16 53.72,16 ; 13.72,15.88 13.72,16 ; 13.72,16 9.04,16 8.26,15.21 8.26,11.94 7.87,11.56 5.08,11.56 3.94,12.7 H11.2 ; 53.72,16 49.04,16 48.26,15.21 48.26,11.94 47.87,11.56 45.08,11.56 43.94,12.7 H11#2.2 ; 53.72,16 53.72,15.88
  Bottom Layer w0.254: v1(36.14,29.77) 28.88,29.77 26.8,27.69 19.81,27.69 ; v1(76.14,29.77) 68.88,29.77 66.8,27.69 59.81,27.69 ; 19.81,27.69 14.1,27.69 13.72,28.07 H1#2.1 ; 19.81,27.69 19.81,22.61 v1(20.07,22.35) ; 59.81,27.69 59.81,22.61 v1(60.07,22.35) ; 59.81,27.69 54.1,27.69 53.72,28.07 H1.1
SPI_MOSI/TDI: length 91.4
  Top Layer w0.254: H11#2.1 46.48,13.94 49.05,16.51 63.88,16.51 64.51,17.15 64.51,21.08 63.93,21.66 U1#2.16 59.81,21.66 59.48,21.99 59.48,25.45 62.61,28.58 62.61,29.85 61.97,30.48 57.53,30.48 H1.3 ; H11.1 6.48,13.94 9.05,16.51 23.88,16.51 24.51,17.15 24.51,21.08 23.93,21.66 U1.16 19.81,21.66 19.48,21.99 19.48,25.45 22.61,28.58 22.61,29.85 21.97,30.48 17.53,30.48 H1#2.3
SPI_SCK/TSTROBE: length 22.3
  Top Layer w0.254: U1.15 19.88,21.01 19.02,21.87 19.02,26.9 H1#2.7 ; H1.7 59.02,26.9 59.02,21.87 59.88,21.01 U1#2.15
TAI: length 29.3
  Top Layer w0.254: H1#2.10 26.29,31.75 26.67,31.37 26.67,25.65 24.63,23.61 U1.19 ; H1.10 66.29,31.75 66.67,31.37 66.67,25.65 64.63,23.61 U1#2.19
TAO: length 25.8
  Top Layer w0.254: H1#2.8 21.84,31.75 23.11,30.48 24.77,30.48 25.15,30.1 25.15,26.04 23.37,24.26 U1.20 ; H1.8 61.84,31.75 63.11,30.48 64.77,30.48 65.15,30.1 65.15,26.04 63.37,24.26 U1#2.20
UART0_RX: length 74.1
  Top Layer w0.254: H10#2.1 48.51,28.45 49.14,27.81 49.14,23.62 49.8,22.96 U1#2.3 57.42,22.96 v1(57.53,22.86) ; 36.2,23.75 v1(36.16,23.75) U4.5 ; 76.2,23.75 v1(76.16,23.75) U4#2.5 ; H10.1 8.51,28.45 9.14,27.81 9.14,23.62 9.81,22.96 U1.3 17.42,22.96 v1(17.53,22.86)
  Bottom Layer w0.254: v1(76.16,23.75) 69.08,23.75 66.04,20.7 59.94,20.7 58.8,21.84 58.8,22.48 58.42,22.86 v1(57.53,22.86) ; v1(36.16,23.75) 29.08,23.75 26.04,20.7 19.94,20.7 18.8,21.84 18.8,22.48 18.42,22.86 v1(17.53,22.86)
UART0_TX: length 79.9
  Top Layer w0.254: v1(36.14,25.77) 36.16,25.78 36.2,25.78 ; v1(17.4,23.62) 17.39,23.61 U1.2 15.79,23.62 10.29,23.62 9.75,24.16 9.75,30.51 9.27,30.99 H9.1 ; H9#2.1 49.27,30.99 49.75,30.51 49.75,24.16 50.29,23.62 55.79,23.62 U1#2.2 57.39,23.61 v1(57.4,23.62) ; 76.2,25.78 76.16,25.78 v1(76.14,25.77)
  Bottom Layer w0.254: v1(17.4,23.62) 18.8,23.62 19.3,23.11 19.3,21.97 19.94,21.34 25.4,21.34 29.83,25.77 v1(36.14,25.77) ; v1(57.4,23.62) 58.8,23.62 59.3,23.11 59.3,21.97 59.94,21.34 65.4,21.34 69.83,25.77 v1(76.14,25.77)
UART1_RX/SWCLK: length 132.4
  Top Layer w0.254: U1.18 25.63,22.96 27.69,25.02 27.69,26.67 28.7,27.69 36.06,27.69 U4.3 37.16,27.77 37.72,28.32 37.72,34.04 35.81,35.94 3.56,35.94 2.29,34.67 2.29,32.64 H9.2 ; U1#2.18 65.63,22.96 67.69,25.02 67.69,26.67 68.7,27.69 76.06,27.69 U4#2.3 77.16,27.77 77.72,28.32 77.72,34.04 75.81,35.94 43.56,35.94 42.29,34.67 42.29,32.64 H9#2.2
UART1_TX: length 81.7
  Top Layer w0.254: U1.8 v1(14.1,19.71) ; U1#2.8 v1(54.1,19.71)
  Bottom Layer w0.254: H10#2.2 41.91,26.42 41.91,11.81 44.06,9.65 47.37,9.65 48.89,11.18 48.89,17.27 49.53,17.91 53.72,17.91 54.1,18.29 v1(54.1,19.71) ; H10.2 1.91,26.42 1.91,11.81 4.06,9.65 7.37,9.65 8.89,11.18 8.89,17.27 9.53,17.91 13.72,17.91 14.1,18.29 v1(14.1,19.71)
$1N831: length 4.1
  Top Layer w2: D1.1 15,49.78 14.94,49.85
$1N1246: length 1.5
  Top Layer w0.254: LED1.2 30.1,46.78 R1.1
$1N1959: length 95.4
  Top Layer w0.254: H5#2.2 0.51,22.48 0.51,10.54 3.07,7.98 26.39,7.98 v1(27.05,8.64) ; H5.2 40.51,22.48 40.51,10.54 43.07,7.98 66.39,7.98 v1(67.05,8.64)
  Bottom Layer w0.254: v1(27.05,8.64) 27.05,11.68 v1(27.04,11.68) ; v1(67.04,11.68) 67.05,11.68 v1(67.05,8.64)
$1N1962: length 93.2
  Top Layer w0.254: R3.1 27.05,13.59 27.94,13.59 28.19,13.34 28.19,10.67 25.99,8.46 3.73,8.46 0.92,11.27 0.92,20.35 H6#2.1 ; H6.1 40.92,20.35 40.92,11.27 43.73,8.46 65.99,8.46 68.19,10.67 68.19,13.34 67.94,13.59 67.05,13.59 R3#2.1
$1N1965: length 3.2
  Top Layer w0.254: LED2.1 23.95,11.68 R2.2 ; LED2#2.1 63.95,11.68 R2#2.2
$1N1968: length 3.3
  Top Layer w0.254: R3#2.2 LED3#2.1 ; R3.2 LED3.1
$1N2989: length 42.9
  Top Layer w0.254: H7#2.1 43.43,15.75 42.54,14.86 42.54,12.54 44.41,10.67 52.83,10.67 54.73,12.57 U3#2.6 57.28,12.57 R4#2.1 ; H7.1 3.43,15.75 2.54,14.86 2.54,12.54 4.41,10.67 12.83,10.67 14.73,12.57 U3.6 17.28,12.57 R4.1
$1N3006: length 49.4
  Top Layer w0.254: H8#2.2 42.16,16.51 42.16,12.17 44.42,9.91 53.21,9.91 54.61,11.3 U3#2.5 57.03,11.3 R5#2.2 ; R5.2 17.03,11.3 U3.5 14.61,11.3 13.21,9.91 4.42,9.91 2.16,12.17 2.16,16.51 H8.2

## Copper pours and planes (outline as drawn; the poured copper is in the pictures)
GND on Top Layer: 0,55 79,55 79,0 0,0
GND on Bottom Layer: 0,55 79,55 79,0 0,0

## Text on the board
Top Silkscreen Layer: PT32x007_Fox01_HTOL_Test_1.0 | 澎湃微电子
